# Altium schematic sheet Voltage Regulator.SchDoc
size A; SheetNumber: 6; SheetTotal: 6
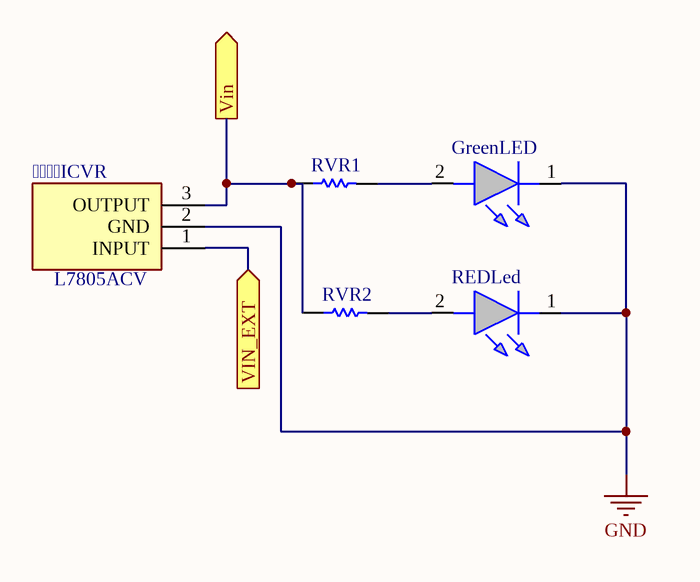
[diagram p0: Voltage Regulator.SchDoc]

## Parts
ICVR  L7805ACV  [TO255P460X1020X2008-3P]
GreenLED  ASCKCG00-NW5X5020302  [ASCKCG00NW5X5020302]  (value not drawn)
REDLed  ASCKCR00-BU5V5020402  [ASCKCR00BU5V5020402]  (value not drawn)
RVR1  CRCW0603110RFKEA  [RESC1609X50X30NL10T20]  (value not drawn)
RVR2  CRCW0603110RFKEA  [RESC1609X50X30NL10T20]  (value not drawn)

## Ports
Vin (out), VIN_EXT (in)

## Nets
GND: ICVR.2(GND) GreenLED.1(K) REDLed.1(K)
Vin: ICVR.3(OUTPUT) RVR1.1 RVR2.1 ; port Vin
VIN_EXT: ICVR.1(INPUT) ; port VIN_EXT
NetGreenLED_2: GreenLED.2(A) RVR1.2
NetREDLed_2: REDLed.2(A) RVR2.2

## Library data of the parts
ICVR = CMP-028-000000-1: Linear voltage regulator,L7805ACV 5V 1A STMicroelectronics L7805ACV, Single Linear Voltage Regulator, 1A 5 V, 2%, 3-Pin TO-220; Geometry.Height: 4.6mm; Manufacturer_Name: STMicroelectronics; Mouser Part Number: 511-L7805ACV; Mouser Price/Stock: https://www.mouser.co.uk/ProductDetail/STMicroelectronics/L7805ACV?qs=xv3lWMc77RdYd2PeLwOwYw%3D%3D; Manufacturer_Part_Number: L7805ACV; Design Item ID: L7805ACV; Datasheet Link: http://www.st.com/web/en/resource/technical/document/datasheet/CD00000444.pdf; Source: L7805ACV.SchLib
GreenLED = CMP-004-00031-1: Green 524nm LED Indication - Discrete 3.3V 0603 (1608 Metric); Manufacturer_Name: Avago Technologies; Geometry.Height: 0.75mm; Mouser Price/Stock: https://www.mouser.co.uk/ProductDetail/Broadcom-Avago/ASCKCG00-NW5X5020302?qs=OcgtsXO%252B3gsRJ%252BJUmBwdbA%3D%3D; Manufacturer_Part_Number: ASCKCG00-NW5X5020302; Source: ASCKCG00-NW5X5020302.SchLib; Design Item ID: ASCKCG00-NW5X5020302; Datasheet Link: https://docs.broadcom.com/doc/ASCKCx00-xxxxx0x0x02-DS; Mouser Part Number: 630-ASCKCG00NW5X5020
REDLed = CMP-004-00032-1: Red 622nm LED Indication - Discrete 2.1V 0603 (1608 Metric); Manufacturer_Name: Avago Technologies; Geometry.Height: 0.75mm; Mouser Part Number: 630-ASCKCR00BU5V5020; Mouser Price/Stock: https://www.mouser.co.uk/ProductDetail/Broadcom-Avago/ASCKCR00-BU5V5020402?qs=OcgtsXO%252B3gu355%2FiA8jcWA%3D%3D; Source: ASCKCR00-BU5V5020402.SchLib; Datasheet Link: https://docs.broadcom.com/doc/ASCKCx00-xxxxx0x0x02-DS; Manufacturer_Part_Number: ASCKCR00-BU5V5020402; Design Item ID: ASCKCR00-BU5V5020402
RVR1 RVR2 = CMP-2000-03854-1: Manufacturer: Vishay Dale; Part Number: CRCW0603110RFKEA